# EasyEDA Pro project 校项 3.0.eprj

# Schematic Schematic1
Board Name: Board1; Create Date: 2024-12-07; Page Name: P1; Project Name: 校项 3.0; Schematic Name: Schematic1; Update Date: 2025-03-07; Add into BOM: yes; Company: 嘉立创EDA; Convert to PCB: yes; Page Size: A4; Version: V1.0
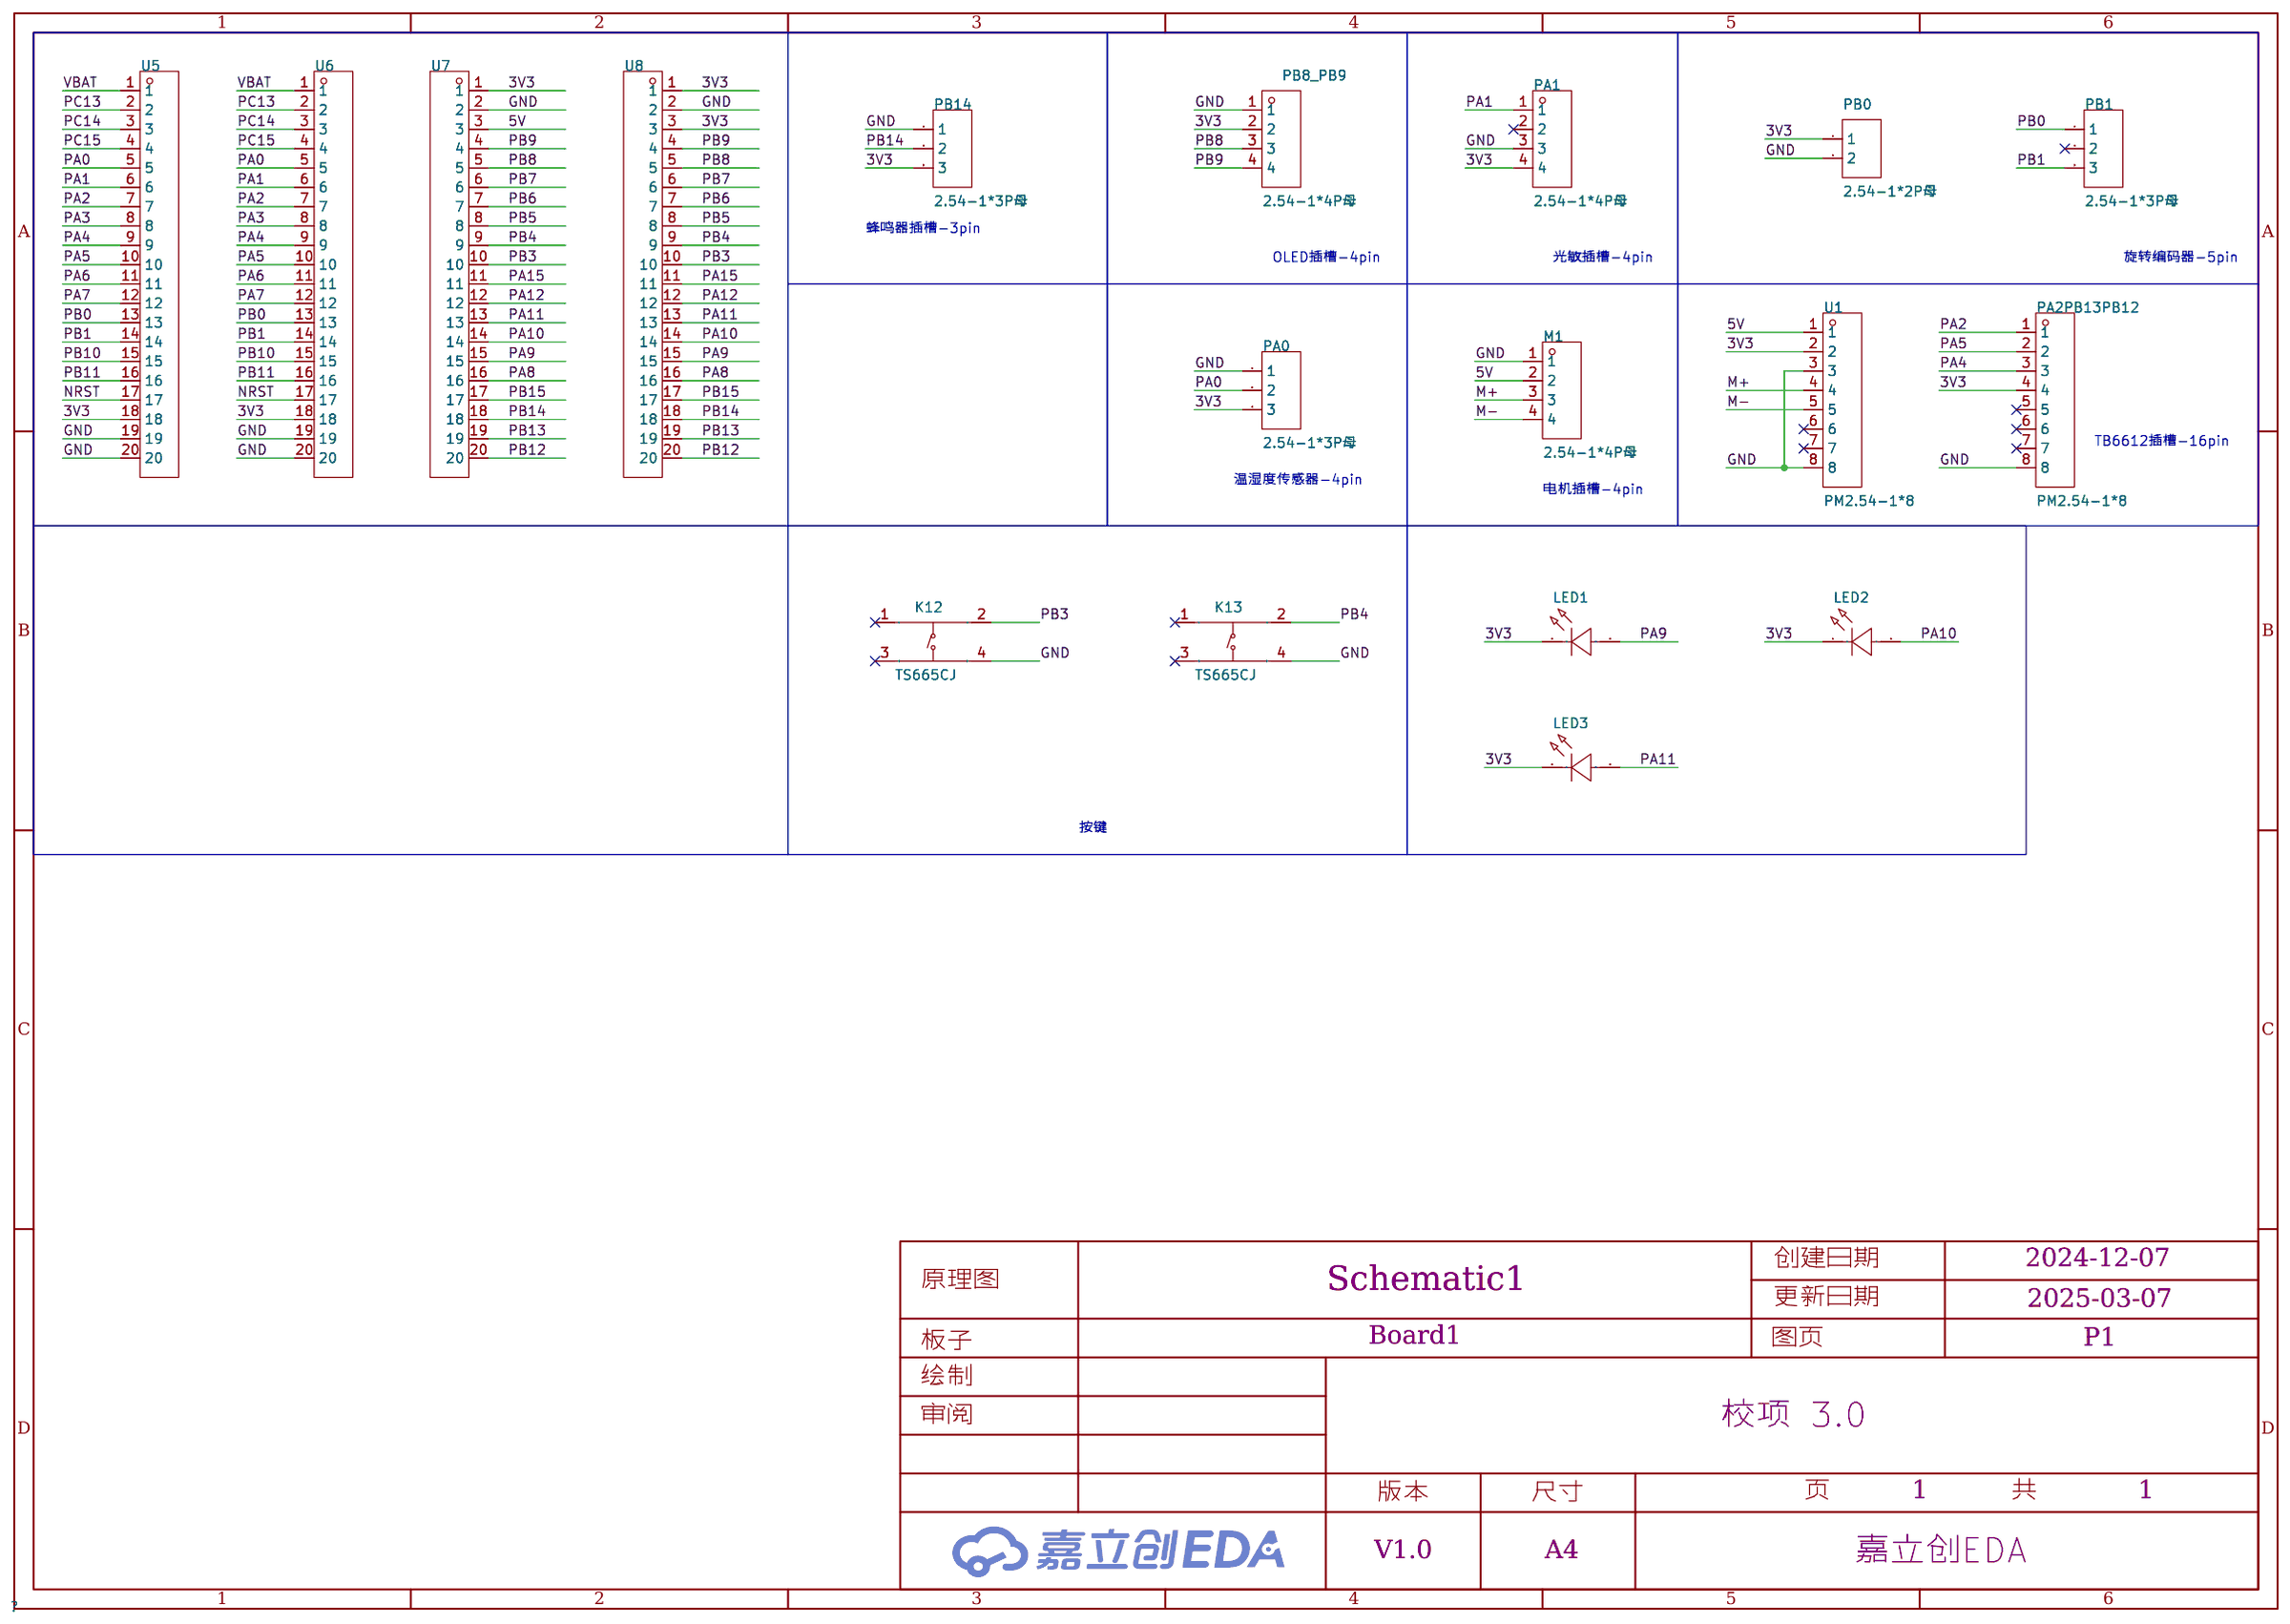
[diagram p0: schematic sheet]

## Parts
K12  TS665CJ  [SW-TH_4P-L6.0-W6.0-P4.50-LS6.5]
K13  TS665CJ  [SW-TH_4P-L6.0-W6.0-P4.50-LS6.5]
LED1  NFD5408BC  [LED-TH_BD5.7-P2.54-RD]
LED2  NFD5408BC  [LED-TH_BD5.7-P2.54-RD]
LED3  NFD5408BC  [LED-TH_BD5.7-P2.54-RD]
M1  2.54-1*4P母  [HDR-TH_4P-P2.54-V-F]
PA0  2.54-1*3P母  [HDR-TH_3P-P2.54-V-F]
PA1  2.54-1*4P母  [HDR-TH_4P-P2.54-V-F]
PA2PB13PB12  PM2.54-1*8  [HDR-TH_8P-P2.54-V-F]
PB0  2.54-1*2P母  [HDR-TH_2P-P2.54-V-F]
PB1  2.54-1*3P母  [HDR-TH_3P-P2.54-V-F]
PB8_PB9  2.54-1*4P母  [HDR-TH_4P-P2.54-V-F]
PB14  2.54-1*3P母  [HDR-TH_3P-P2.54-V-F]
U1  PM2.54-1*8  [HDR-TH_8P-P2.54-V-F]
U5  KH-2.54FH-1X20P-H8.5  [HDR-TH_20P-P2.54-V-F-2]
U6  KH-2.54FH-1X20P-H8.5  [HDR-TH_20P-P2.54-V-F-2]
U7  KH-2.54FH-1X20P-H8.5  [HDR-TH_20P-P2.54-V-F-2]
U8  KH-2.54FH-1X20P-H8.5  [HDR-TH_20P-P2.54-V-F-2]

## Library data of the parts
K12 K13 = TS665CJ: 电路结构:单刀单掷;按钮形状:圆形按钮;安装方式:直插;开关长度:6mm;开关宽度:6mm;开关高度:5mm;触点电流:50mA;额定电压(DC):12V;带灯:-;机械寿命:-;; LCSC Part Name: 6*6*5mm 直插 轻触开关; Supplier Part: C393938; Manufacturer: SHOU HAN(首韩); Supplier Footprint: 插件; JLCPCB Part Class: 扩展库; Datasheet: https://atta.szlcsc.com/upload/public/pdf/source/20190521/C393938_BDABEAC600B4C55E200A80AA129B70BC.pdf; Supplier: LCSC; Circuit: 单刀单掷; Actuator Style: 圆形按钮; Mounting Style: 直插; Switch Length: 6mm; Switch Width: 6mm; Switch Height: 5mm; Contact Current: 50mA; Voltage Rating (DC): 12V
LED1-LED3 = NFD5408BC: LCSC Part Name: 发光二极管/LED; Supplier Part: C20618158; Manufacturer: 国星光电; Supplier Footprint: 插件,D=5mm; JLCPCB Part Class: 扩展库; Datasheet: https://atta.szlcsc.com/upload/public/pdf/source/20240202/FDA91858A41DA632758C1664CA47056B.pdf; Supplier: LCSC; Emitted Color: 蓝色; Power Dissipation: 200mW; Dominant Wavelength: 460nm~470nm; Viewing Angle: 20°; Operating Temperature: -30℃~+85℃
M1 PA1 PB8_PB9 = 2.54-1*4P母: 插孔结构:1x4P;间距:2.54mm;行距:-;圆孔/方孔:方孔;安装类型:直插;排数:单排;总孔位数:4P;额定电流:3A;额定电压:-;插孔方向:顶部;塑高:-;触头材质:青铜;触头镀层:-;工作温度范围:-40℃~+105℃;焊接温度(最大值):-;; LCSC Part Name: 间距:2.54mm 1x4P 直插; Supplier Part: C2718488; Manufacturer: BOOMELE(博穆精密); Supplier Footprint: 插件,P=2.54mm; JLCPCB Part Class: 扩展库; Datasheet: https://atta.szlcsc.com/upload/public/pdf/source/20210301/C2718488_F4427B881E42CAA8DDB0B1C12B3A522C.pdf; Supplier: LCSC; Holes Structure: 1x4P; Pitch: 2.54mm; Circular Hole / Square Hole: 方孔; Mounting Type: 直插; Number of Rows: 单排; Number of Holes: 4P; Current Rating (Max): 3A; Holes Direction: 顶部; Contact Material: 青铜; Operating Temperature Range: -40℃~+105℃
PA0 PB1 PB14 = 2.54-1*3P母: 间距:2.54mm;行距:-;安装类型:直插;排数:单排;总孔位数:3P;塑高:-;触头材质:-;触头镀层:金;; LCSC Part Name: 间距:2.54mm 直插; Supplier Part: C146243; Manufacturer: BOOMELE(博穆精密); Supplier Footprint: 插件,P=2.54mm; JLCPCB Part Class: 扩展库; Supplier: LCSC; Pitch: 2.54mm; Mounting Type: 直插; Number of Rows: 单排; Number of Holes: 3P; Contact Plating: 金
PA2PB13PB12 U1 = PM2.54-1*8: 插孔结构:1x8P;间距:2.54mm;行距:2.54mm;圆孔/方孔:方孔;安装类型:直插;排数:单排;总孔位数:8P;额定电流:2.5A;插孔方向:顶部;塑高:8.5mm;工作温度范围:-40℃~+105℃;; LCSC Part Name: 间距:2.54mm 1x8P 直插; Supplier Part: C5224027; Manufacturer: ZHOURI(洲日); Supplier Footprint: 插件,P=2.54mm; JLCPCB Part Class: 扩展库; Datasheet: https://atta.szlcsc.com/upload/public/pdf/source/20221031/E5BAE727A502DC7C69CE947E807E2296.pdf; Supplier: LCSC; Holes Structure: 1x8P; Pitch: 2.54mm; Row Spacing: 2.54mm; Circular Hole / Square Hole: 方孔; Mounting Type: 直插; Number of Rows: 单排; Number of Holes: 8P; Current Rating (Max): 2.5A; Holes Direction: 顶部; Insulation Height: 8.5mm; Operating Temperature Range: -40℃~+105℃
PB0 = 2.54-1*2P母: 插孔结构:1x2P;间距:2.54mm;行距:-;安装类型:直插;排数:单排;总孔位数:2P;塑高:-;触头材质:-;触头镀层:-;; LCSC Part Name: 间距:2.54mm 1x2P 直插; Supplier Part: C49661; Manufacturer: BOOMELE(博穆精密); Supplier Footprint: 插件,P=2.54mm; JLCPCB Part Class: 扩展库; Datasheet: https://atta.szlcsc.com/upload/public/pdf/source/20210301/C2718488_F4427B881E42CAA8DDB0B1C12B3A522C.pdf; Supplier: LCSC; Holes Structure: 1x2P; Pitch: 2.54mm; Mounting Type: 直插; Number of Rows: 单排; Number of Holes: 2P
U5-U8 = KH-2.54FH-1X20P-H8.5: 插孔结构:1x20P;间距:2.54mm;行距:-;圆孔/方孔:方孔;安装类型:直插;排数:单排;总孔位数:20P;额定电流:3A;额定电压:-;插孔方向:顶部;塑高:8.5mm;工作温度范围:-40℃~+105℃;; LCSC Part Name: 间距:2.54mm 1x20P 直插; Supplier Part: C2905423; Manufacturer: kinghelm(金航标); Supplier Footprint: 插件,P=2.54mm; JLCPCB Part Class: 扩展库; Datasheet: https://atta.szlcsc.com/upload/public/pdf/source/20211019/BDB673907948473CE61C8A1CF06C5BF5.pdf; Supplier: LCSC; Holes Structure: 1x20P; Pitch: 2.54mm; Circular Hole / Square Hole: 方孔; Mounting Type: 直插; Number of Rows: 单排; Number of Holes: 20P; Current Rating (Max): 3A; Holes Direction: 顶部; Insulation Height: 8.5mm; Operating Temperature Range: -40℃~+105℃

## Nets
3V3: LED1.1(K) LED2.1(K) LED3.1(K) PA0.3 PA1.4 PA2PB13PB12.4 PB0.1 PB8_PB9.2 PB14.3 U1.2 U5.18 U6.18 U7.1 U8.1 U8.3
5V: M1.2 U1.1 U7.3
GND: K12.4(D) K13.4(D) M1.1 PA0.1 PA1.3 PA2PB13PB12.8 PB0.2 PB8_PB9.1 PB14.1 U1.3 U1.8 U5.19 U5.20 U6.19 U6.20 U7.2 U8.2
VBAT: U5.1 U6.1
M+: M1.3 U1.4
M-: M1.4 U1.5
NRST: U5.17 U6.17
PA0: PA0.2 U5.5 U6.5
PA1: PA1.1 U5.6 U6.6
PA2: PA2PB13PB12.1 U5.7 U6.7
PA3: U5.8 U6.8
PA4: PA2PB13PB12.3 U5.9 U6.9
PA5: PA2PB13PB12.2 U5.10 U6.10
PA6: U5.11 U6.11
PA7: U5.12 U6.12
PA8: U7.16 U8.16
PA9: LED1.2(A) U7.15 U8.15
PA10: LED2.2(A) U7.14 U8.14
PA11: LED3.2(A) U7.13 U8.13
PA12: U7.12 U8.12
PA15: U7.11 U8.11
PB0: PB1.1 U5.13 U6.13
PB1: PB1.3 U5.14 U6.14
PB3: K12.2(B) U7.10 U8.10
PB4: K13.2(B) U7.9 U8.9
PB5: U7.8 U8.8
PB6: U7.7 U8.7
PB7: U7.6 U8.6
PB8: PB8_PB9.3 U7.5 U8.5
PB9: PB8_PB9.4 U7.4 U8.4
PB10: U5.15 U6.15
PB11: U5.16 U6.16
PB12: U7.20 U8.20
PB13: U7.19 U8.19
PB14: PB14.2 U7.18 U8.18
PB15: U7.17 U8.17
PC13: U5.2 U6.2
PC14: U5.3 U6.3
PC15: U5.4 U6.4

Not connected (* = marked no-connect by the designer): K12 1(A)* 3(C)*; K13 1(A)* 3(C)*; PA1 2*; PA2PB13PB12 5* 6* 7*; PB1 2*; U1 6* 7*

## Notes on the sheet
- 蜂鸣器插槽-3pin
- OLED插槽-4pin
- 光敏插槽-4pin
- 旋转编码器-5pin
- TB6612插槽-16pin
- 温湿度传感器-4pin
- 电机插槽-4pin
- 按键

# Board PCB2
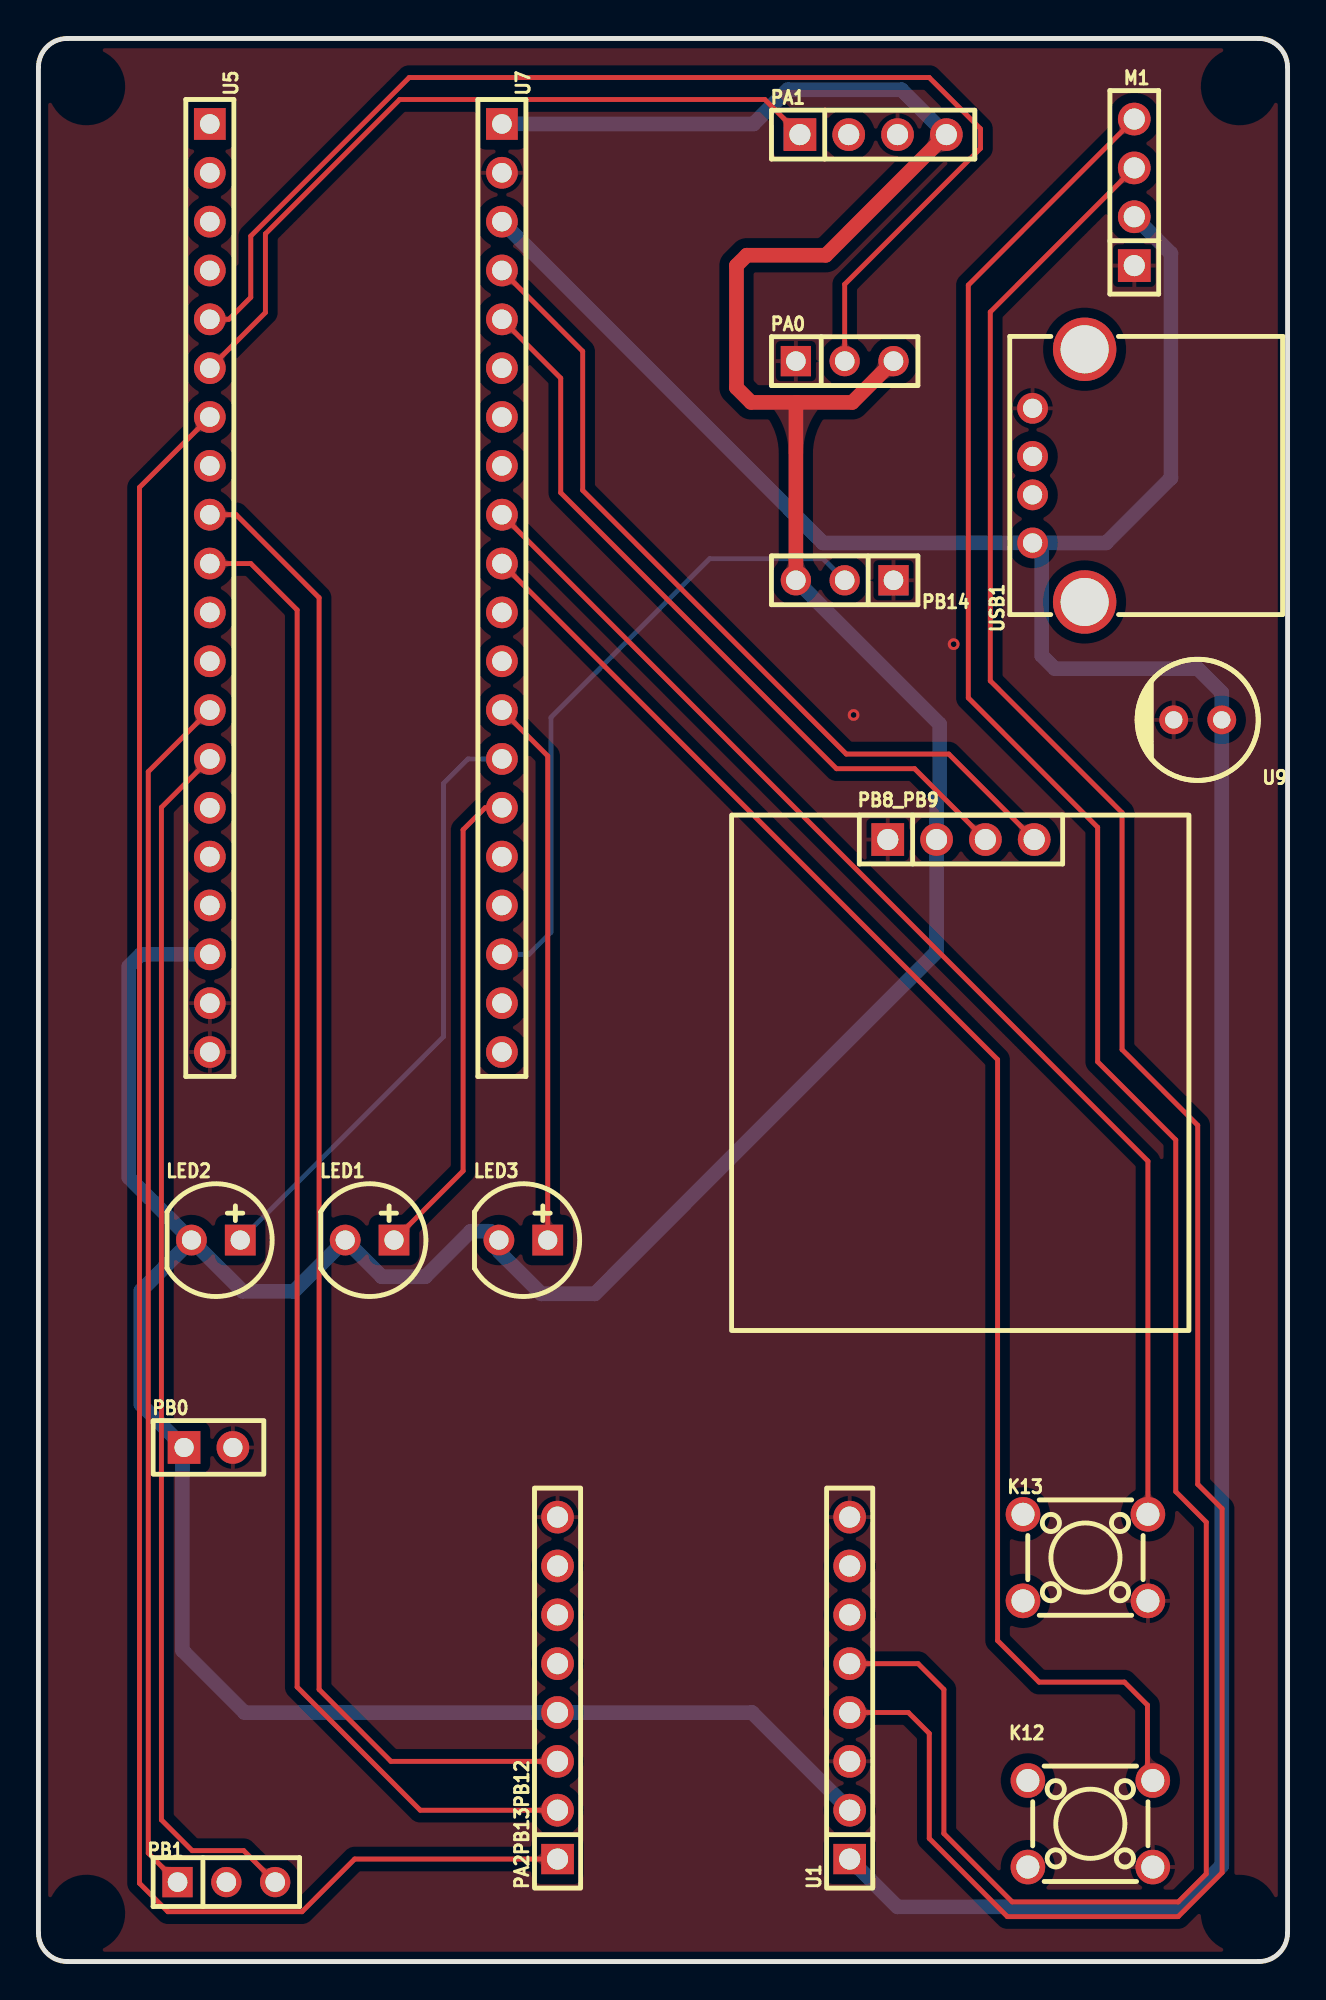
[diagram p1: board, top side]
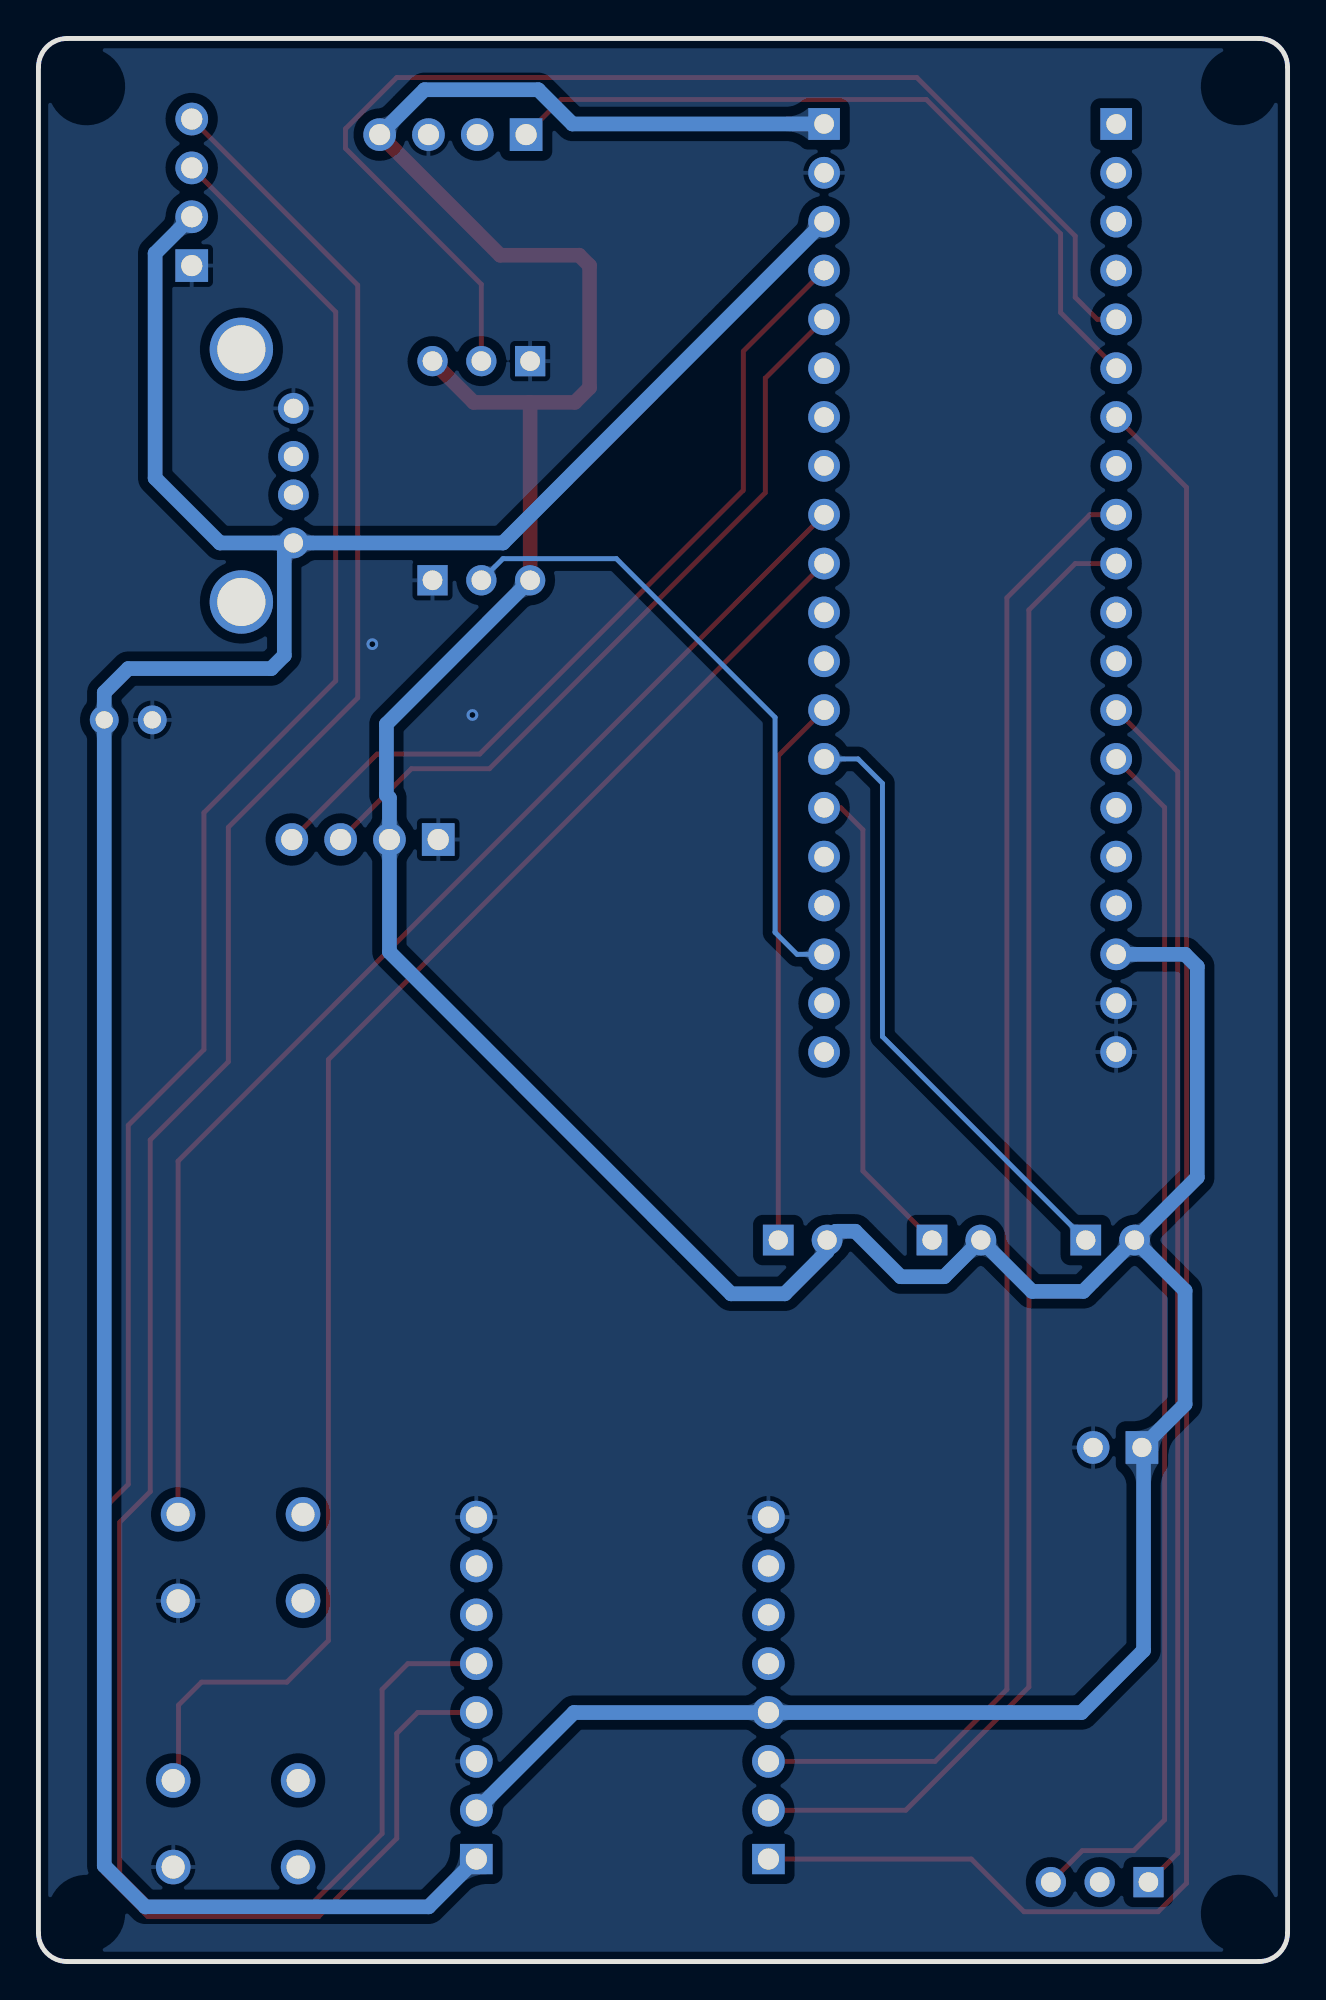
[diagram p2: board, bottom side, seen from below]

Outline 65 x 100 mm; copper layers: Top Layer, Bottom Layer. Coordinates in mm from the lower left corner of the outline.
Outline path: 0,98.5 0,1.5 arc(0.44,0.44) 1.5,0 63.5,0 arc(64.56,0.44) 65,1.5 65,98.5 arc(64.56,99.56) 63.5,100 1.5,100 arc(0.44,99.56) 0,98.5
Stack: Top Layer 0.035mm / Dielectric1 1.51mm FR4 er 4.5 / Bottom Layer 0.035mm

## Design rules (mm)
template: my pcb
spacing copperThickness1oz (default): track to track 0.203, other pairs 0.203 to 0.203
track width copperThickness1oz (default): min 0.254, default 0.254, max 0.762
track width VCC and  GND: min 0.254, default 0.762, max 0.762
differential pair differentialPair (default): width min 0.127, default 0.254, max 2.54; gap min 0.152, default 0.152
via viaSize (default): diameter min 0.5, default 0.61, max 10; hole min 0.3, default 0.305, max 6.299
net GND uses VCC and  GND
net 3V3 uses VCC and  GND
net 5V uses VCC and  GND

## Placement (name value [footprint] x y rotation side)
K12  TS665CJ  [SW-TH_4P-L6.0-W6.0-P4.50-LS6.5]  54.74 7.16 0 top
K13  TS665CJ  [SW-TH_4P-L6.0-W6.0-P4.50-LS6.5]  54.48 21.01 0 top
LED1  NFD5408BC  [LED-TH_BD5.7-P2.54-RD]  17.23 37.52 0 top
LED2  NFD5408BC  [LED-TH_BD5.7-P2.54-RD]  9.23 37.52 0 top
LED3  NFD5408BC  [LED-TH_BD5.7-P2.54-RD]  25.23 37.52 0 top
M1  2.54-1*4P母  [HDR-TH_4P-P2.54-V-F]  57.02 92 90 top
PA0  2.54-1*3P母  [HDR-TH_3P-P2.54-V-F]  41.95 83.22 0 top
PA1  2.54-1*4P母  [HDR-TH_4P-P2.54-V-F]  43.43 95 0 top
PA2PB13PB12  PM2.54-1*8  [HDR-TH_8P-P2.54-V-F]  27.01 14.22 90 top
PB0  2.54-1*2P母  [HDR-TH_2P-P2.54-V-F]  8.85 26.73 0 top
PB1  2.54-1*3P母  [HDR-TH_3P-P2.54-V-F]  9.78 4.13 0 top
PB8_PB9  2.54-1*4P母  [HDR-TH_4P-P2.54-V-F]  48.01 58.34 0 top
PB14  2.54-1*3P母  [HDR-TH_3P-P2.54-V-F]  41.95 71.83 180 top
U1  PM2.54-1*8  [HDR-TH_8P-P2.54-V-F]  42.21 14.22 90 top
U5  KH-2.54FH-1X20P-H8.5  [HDR-TH_20P-P2.54-V-F-2]  8.92 71.42 270 top
U7  KH-2.54FH-1X20P-H8.5  [HDR-TH_20P-P2.54-V-F-2]  24.12 71.42 270 top
U9  220uF  [CAP-TH_BD6.3-P2.50-D0.5-FD]  60.32 64.57 180 top
USB1  USB-231-ARY  [USB-A-TH_USB-231-ARY]  53.09 77.27 90 top

## Footprints (pads in the part's own frame, mm; a bottom-side part is the same pattern mirrored in y, then rotated)
CAP-TH_BD6.3-P2.50-D0.5-FD
  round 1.5 hole 0.9: 1(-1.25,0) 2(1.25,0)
HDR-TH_2P-P2.54-V-F
  rect 1.7x1.7 hole 1: 1(-1.27,0)
  round 1.7 hole 1: 2(1.27,0)
HDR-TH_3P-P2.54-V-F
  rect 1.575x1.575 hole 1.02: 1(-2.54,0)
  round 1.575 hole 1.02: 2(0,0) 3(2.54,0)
HDR-TH_4P-P2.54-V-F
  rect 1.7x1.7 hole 1.1: 1(-3.81,0)
  round 1.7 hole 1.1: 2(-1.27,0) 3(1.27,0) 4(3.81,0)
HDR-TH_8P-P2.54-V-F
  rect 1.575x1.7 hole 1.1: 1(-8.89,0)
  round 1.7 hole 1.1: 2(-6.35,0) 3(-3.81,0) 4(-1.27,0) 5(1.27,0) 6(3.81,0) 7(6.35,0) 8(8.89,0)
HDR-TH_20P-P2.54-V-F-2
  rect 1.65x1.65 hole 1.02: 1(-24.13,0)
  round 1.65 hole 1.02: 2(-21.59,0) 3(-19.05,0) 4(-16.51,0) 5(-13.97,0) 6(-11.43,0) 7(-8.89,0) 8(-6.35,0) 9(-3.81,0) 10(-1.27,0) 11(1.27,0) 12(3.81,0) 13(6.35,0) 14(8.89,0) 15(11.43,0) 16(13.97,0) 17(16.51,0) 18(19.05,0) 19(21.59,0) 20(24.13,0)
LED-TH_BD5.7-P2.54-RD
  round 1.6 hole 1: 1(-1.27,0)
  rect 1.6x1.6 hole 1: 2(1.27,0)
SW-TH_4P-L6.0-W6.0-P4.50-LS6.5
  round 1.8 hole 1.2: 1(-3.25,2.25) 2(3.25,2.25) 3(-3.25,-2.25) 4(3.25,-2.25)
USB-A-TH_USB-231-ARY
  round 1.6 hole 1: 1(-3.5,1.355) 2(-1,1.355) 3(1,1.355) 4(3.5,1.355)
  round 3.3 hole 2.5: 5(-6.57,-1.355) 6(6.57,-1.355)

## Nets
As in the schematic, except:
5V: M1.2 U1.1 U7.3 U9.1 USB1.1
GND: K12.4 K13.4 M1.1 PA0.1 PA1.3 PA2PB13PB12.8 PB0.2 PB8_PB9.1 PB14.1 U1.3 U1.8 U5.19 U5.20 U7.2 U9.2 USB1.4

Pads without a net: K12 1 3; K13 1 3; PA1 2; PA2PB13PB12 5 6 7; PB1 2; U1 6 7; USB1 2 3 5 6

## Via types
v1: diameter 0.61, hole 0.305, Top Layer to Bottom Layer, 2 vias

## Routing (per net, layer and track width the routed paths; a pad name or vN(x,y) marks a point on that pad's centre or on a via; arc(x,y) is an arc through that point)
3V3: length 219.5
  Top Layer w0.762: PA0.3 42.35,81.08 39.45,81.08 ; 39.45,81.08 37.08,81.08 36.32,81.84 36.32,88.19 36.86,88.73 40.97,88.73 PA1.4 ; 39.45,81.08 39.41,81.04 PB14.3
  Bottom Layer w0.762: PB14.3 46.89,64.34 46.89,60.66 46.74,60.5 PB8_PB9.2 46.74,52.5 28.96,34.72 26.16,34.72 23.96,36.92 LED3.1 23.5,37.97 22.49,37.97 20.13,35.61 17.87,35.61 LED1.1 13.29,34.85 10.63,34.85 LED2.1 ; 24.12,95.56 37.21,95.56 38.99,97.33 44.91,97.33 PA1.4 ; U1.2 37.13,12.95 PA2PB13PB12.4 10.72,12.95 7.49,16.18 7.49,26.65 PB0.1 5.33,28.98 5.33,34.89 LED2.1 ; U5.18 5.33,52.38 4.7,51.74 4.7,40.78 LED2.1
5V: length 156
  Bottom Layer w0.762: M1.2 58.93,88.82 58.93,77.14 55.56,73.77 USB1.1 ; USB1.1 52.21,73.29 52.21,67.91 52.89,67.23 60.32,67.23 61.57,65.98 U9.1 61.57,4.98 59.44,2.84 44.7,2.84 U1.1 ; USB1.1 40.83,73.77 U7.3
GND:
  vias: v1(42.42,64.82) v1(47.62,68.5)
M+: length 124.7
  Top Layer w0.254: M1.3 49.53,85.78 49.53,66.6 56.39,59.74 56.39,47.42 60.32,43.48 60.32,24.82 61.59,23.55 61.59,4.62 59.31,2.34 50.42,2.34 46.35,6.4 46.35,11.86 45.27,12.95 U1.4
M-: length 128.6
  Top Layer w0.254: M1.4 48.39,87.17 48.39,65.71 55.12,58.98 55.12,46.79 59.18,42.72 59.18,24.44 60.77,22.85 60.77,4.56 59.31,3.1 50.67,3.1 47.12,6.66 47.12,14.15 45.78,15.49 U1.5
PA0: length 63.3
  Top Layer w0.254: PA0.2 41.95,87.22 49.02,94.28 49.02,95.3 46.35,97.97 19.29,97.97 11.05,89.72 11.05,86.54 9.91,85.39 U5.5
PA1: length 39.6
  Top Layer w0.254: PA1.1 37.8,96.83 18.8,96.83 11.81,89.84 11.81,85.75 8.92,82.86
PA2: length 101.3
  Top Layer w0.254: U5.7 5.26,76.66 5.26,4.07 6.74,2.59 13.72,2.59 16.45,5.33 PA2PB13PB12.1
PA4: length 78.2
  Top Layer w0.254: U5.9 10.29,75.23 14.6,70.92 14.6,14.15 18.34,10.41 PA2PB13PB12.3
PA5: length 77.8
  Top Layer w0.254: PA2PB13PB12.2 19.87,7.87 13.46,14.28 13.46,70.28 11.05,72.69 U5.10
PA9: length 25.3
  Top Layer w0.254: LED1.2 22.1,41.11 22.1,58.85 23.24,60 U7.15
PA10: length 31.7
  Bottom Layer w0.254: LED2.2 21.08,48.1 21.08,61.27 22.35,62.53 U7.14
PA11: length 28.5
  Top Layer w0.254: LED3.2 26.5,62.69 U7.13
PB0: length 62.9
  Top Layer w0.254: 7.24,4.13 7.22,4.13 5.72,5.64 5.72,61.87 U5.13
PB1: length 63.5
  Top Layer w0.254: U5.14 6.4,60.02 6.4,7.37 8,5.77 10.68,5.77 PB1.3
PB3: length 79.9
  Top Layer w0.254: K12.2 57.71,9.69 57.71,13.33 56.51,14.53 52.07,14.53 49.91,16.69 49.91,46.9 U7.10
PB4: length 65.9
  Top Layer w0.254: K13.2 57.73,41.62 U7.9
PB8: length 39.9
  Top Layer w0.254: U7.5 27.18,82.33 27.18,76.38 41.53,62.03 45.59,62.03 PB8_PB9.3
PB9: length 44.2
  Top Layer w0.254: PB8_PB9.4 47.37,62.79 42.04,62.79 28.32,76.5 28.32,83.73 U7.4
PB14: length 33.4
  Bottom Layer w0.254: U7.18 25.53,52.38 26.67,53.52 26.67,64.69 34.93,72.95 40.83,72.95 PB14.2

## Copper pours and planes (outline as drawn; the poured copper is in the pictures)
GND on Top Layer: -8.38,104.06 80.01,104.06 80.01,-10.11 -8.38,-10.11
GND on Bottom Layer: -19.81,111.3 78.23,111.3 78.23,-13.66 -19.81,-13.66

Small or netless copper shapes (teardrops, artwork), in the pictures only: 34 on Top Layer, 30 on Bottom Layer
